# EAGLE design hrobot (EAGLE 9.6.2)
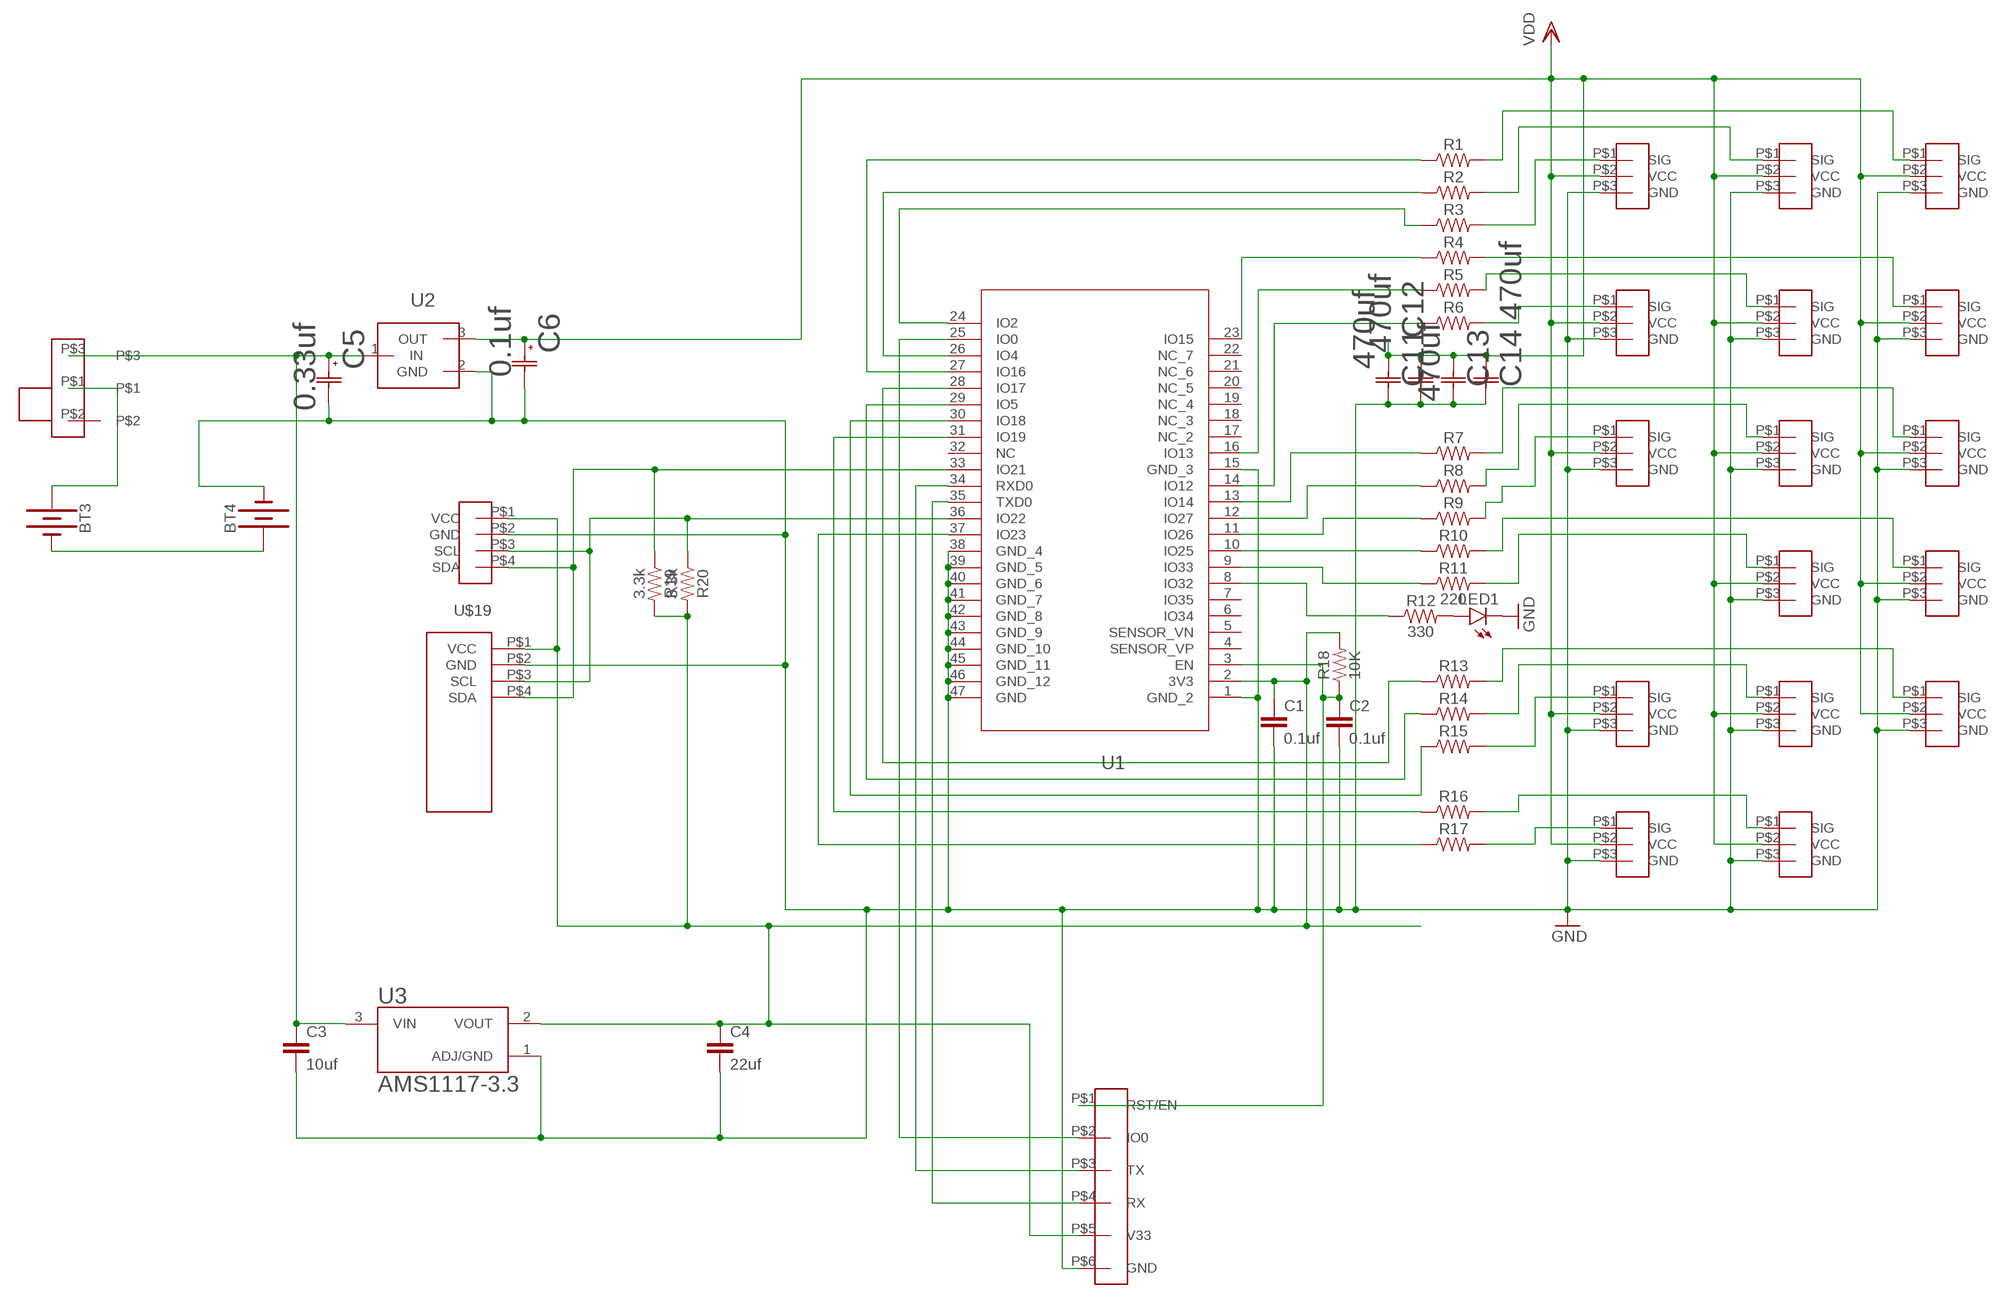
[diagram p0: schematic, sheet 1]

## Parts
BT3  BATTERY-18650  [BATTERY_18650-HOLDER]
BT4  BATTERY-18650  [BATTERY_18650-HOLDER]
C1  0.1uf  CAP-0805  [0805]
C2  0.1uf  CAP-0805  [0805]
C3  10uf  CAP-0805  [0805]
C4  22uf  CAP-0805  [0805]
C5  0.33uf  UWP1HR33MCL1GBCAP_UWF_4X5P4_NCH  [CAP_UWF_4X5P4_NCH]
C6  0.1uf  UZR1H0R1MCL1GBCAP_UZE_4X3P9_NCH  [CAP_UZE_4X3P9_NCH]
C11  470uf  16TZV470M8X10.5CAP_J-V_8X10P5_RUB  [CAP_J-V_8X10P5_RUB]
C12  470uf  16TZV470M8X10.5CAP_J-V_8X10P5_RUB  [CAP_J-V_8X10P5_RUB]
C13  470uf  16TZV470M8X10.5CAP_J-V_8X10P5_RUB  [CAP_J-V_8X10P5_RUB]
C14  470uf  16TZV470M8X10.5CAP_J-V_8X10P5_RUB  [CAP_J-V_8X10P5_RUB]
LED1  LEDSML0805  [SML0805]
R1  RESISTOR0805  [0805]
R2  RESISTOR0805  [0805]
R3  RESISTOR0805  [0805]
R4  RESISTOR0805  [0805]
R5  RESISTOR0805  [0805]
R6  RESISTOR0805  [0805]
R7  RESISTOR0805  [0805]
R8  RESISTOR0805  [0805]
R9  RESISTOR0805  [0805]
R10  RESISTOR0805  [0805]
R11  220  RESISTOR0805  [0805]
R12  330  RESISTOR0805  [0805]
R13  RESISTOR0805  [0805]
R14  RESISTOR0805  [0805]
R15  RESISTOR0805  [0805]
R16  RESISTOR0805  [0805]
R17  RESISTOR0805  [0805]
R18  10K  RESISTOR0805  [0805]
R19  3.3k  RESISTOR0805  [0805]
R20  3.3k  RESISTOR0805  [0805]
U1  ESP32-WROOM-32E_(4MB)ESP32�WROOM�32E_EXP  [ESP32�WROOM�32E_EXP]
U2  L7806  L7805  [L7805FOOT]
U3  AMS1117-3.3  [SOT229P700X180-4N]
U$1  SERVO  [3PINS]
U$2  SERVO  [3PINS]
U$3  SERVO  [3PINS]
U$5  SERVO  [3PINS]
U$6  SERVO  [3PINS]
U$7  SERVO  [3PINS]
U$8  SERVO  [3PINS]
U$9  SERVO  [3PINS]
U$10  SERVO  [3PINS]
U$11  SERVO  [3PINS]
U$12  SERVO  [3PINS]
U$13  SERVO  [3PINS]
U$14  SERVO  [3PINS]
U$15  SERVO  [3PINS]
U$16  SERVO  [3PINS]
U$17  SERVO  [3PINS]
U$18  OLEDVCC  [OLEPINS]
U$19  GYRO  [4PINS]
U$20  PWR3PINS  [PWR3PINS]
U$23  USBCOUT  [6PINS]

## Nets
3V3: C1.1 C4.1 R18.2 R19.2 R20.2 U1.2(3V3) U3.2(VOUT) U$18.P$1(VCC) U$19.P$1(VCC) U$23.P$5(V33)
GND: BT4.GND@1(-) C1.2 C2.2 C3.2 C4.2 C5.2 C6.2 C11.2 C12.2 C13.2 C14.2 LED1.C U1.1(GND_2) U1.15(GND_3) U1.38(GND_4) U1.39(GND_5) U1.40(GND_6) U1.41(GND_7) U1.42(GND_8) U1.43(GND_9) U1.44(GND_10) U1.45(GND_11) U1.46(GND_12) U1.47(GND) U2.2(GND) U3.1(ADJ/GND) U$1.P$3(GND) U$2.P$3(GND) U$3.P$3(GND) U$5.P$3(GND) U$6.P$3(GND) U$7.P$3(GND) U$8.P$3(GND) U$9.P$3(GND) U$10.P$3(GND) U$11.P$3(GND) U$12.P$3(GND) U$13.P$3(GND) U$14.P$3(GND) U$15.P$3(GND) U$16.P$3(GND) U$17.P$3(GND) U$18.P$2(GND) U$19.P$2(GND) U$23.P$6(GND)
N$1: BT3.GND@1(-) BT4.PWR@1(+)
N$2: BT3.PWR@1(+) U$20.P$1
N$4: R3.2 U$1.P$1(SIG)
N$5: R2.2 U$7.P$1(SIG)
N$6: R1.2 U$13.P$1(SIG)
N$7: R6.2 U$2.P$1(SIG)
N$8: R5.2 U$8.P$1(SIG)
N$9: R4.2 U$14.P$1(SIG)
N$10: R9.2 U$3.P$1(SIG)
N$11: R8.2 U$9.P$1(SIG)
N$12: R7.2 U$15.P$1(SIG)
N$13: LED1.A R12.2
N$14: R11.2 U$10.P$1(SIG)
N$15: R10.2 U$16.P$1(SIG)
N$16: R15.2 U$5.P$1(SIG)
N$17: R14.2 U$11.P$1(SIG)
N$18: R13.2 U$17.P$1(SIG)
N$19: R17.2 U$6.P$1(SIG)
N$20: R16.2 U$12.P$1(SIG)
N$21: C3.1 C5.1 U2.1(IN) U3.3(VIN) U$20.P$3
N$22: R16.1 U1.31(IO19)
N$23: R1.1 U1.27(IO16)
N$24: R2.1 U1.26(IO4)
N$25: C2.1 R18.1 U1.3(EN) U$23.P$1(RST/EN)
N$26: R4.1 U1.23(IO15)
N$27: R5.1 U1.16(IO13)
N$28: R6.1 U1.14(IO12)
N$29: R17.1 U1.37(IO23)
N$31: R14.1 U1.29(IO5)
N$32: R15.1 U1.30(IO18)
N$34: R13.1 U1.28(IO17)
N$35: R19.1 U1.33(IO21) U$18.P$4(SDA) U$19.P$4(SDA)
N$36: R11.1 U1.9(IO33)
N$37: R10.1 U1.10(IO25)
N$38: R9.1 U1.11(IO26)
N$39: R8.1 U1.12(IO27)
N$40: R7.1 U1.13(IO14)
N$42: R20.1 U1.36(IO22) U$18.P$3(SCL) U$19.P$3(SCL)
N$45: R12.1 U1.8(IO32)
N$46: R3.1 U1.24(IO2)
N$54: U1.35(TXD0) U$23.P$4(RX)
N$55: U1.34(RXD0) U$23.P$3(TX)
N$57: U1.25(IO0) U$23.P$2(IO0)
VDD: C6.1 C11.1 C12.1 C13.1 C14.1 U2.3(OUT) U$1.P$2(VCC) U$2.P$2(VCC) U$3.P$2(VCC) U$5.P$2(VCC) U$6.P$2(VCC) U$7.P$2(VCC) U$8.P$2(VCC) U$9.P$2(VCC) U$10.P$2(VCC) U$11.P$2(VCC) U$12.P$2(VCC) U$13.P$2(VCC) U$14.P$2(VCC) U$15.P$2(VCC) U$16.P$2(VCC) U$17.P$2(VCC)
Unconnected: U1.4(SENSOR_VP) U1.5(SENSOR_VN) U1.6(IO34) U1.7(IO35) U1.17(NC_2) U1.18(NC_3) U1.19(NC_4) U1.20(NC_5) U1.21(NC_6) U1.22(NC_7) U1.32(NC) U$20.P$2

## Library data of the parts
BT3 BT4 = SparkFun-Batteries:BATTERY: Battery - Single Cell A variety of battery chemistries, sizes, and footprints. Device List: 20MM_PTH - Coin Cell Battery Holder - 20mm (PTH) <https://www.sparkfun.com/products/783> 20MM_PTH_KIT- Coin Cell battery Holder - 20 mm (PTH) <http://www.sparkfun.com/products/783>kit version with special mask 6.8MM_PTH - Coin Cell Battery Holder - 6.8MM(SMD) <https://www.digikey.com/product-detail/en/seiko-instruments/MS621FE-FL11E/728-1057-ND/1889208?WT.srch=1&gclid=CNOQ5a6LzdQCFZS2wAodXCkE0g> 12MM_SMD - Coin Cell Battery Holder - 12mm (SMD) <https://www.sparkfun.com/products/10592> 12MM_PTH - Coin Cell Battery Holder - 12mm (PTH) <https://www.sparkfun.com/products/7948> 20MM_SMD - 20mm Coin Cell Battery Holder (SMD) (2 legs) Used on the Big Time Watch Kit <https://www.sparkfun.com/products/11734> 20MM_SMD_4LEGS - Coin Cell Battery Holder - 20mm (SMD) <https://www.sparkfun.com/products/11892> 20MM_SMD_4LEGS_OVERPASTE - Coin Cell Battery Holder - 20mm (SMD) <https://www.sparkfun.com/products/11892> (Over-paste on the legs) 24.5MM_PTH - Coin Cell Battery Holder - 24.5mm (PTH) <https://www.sparkfun.com/products/8863> 9V - 9V Battery Holder - PC Mount Used on the SparkFun SparkPunk Sound Kit <https://www.sparkfun.com/products/11177> and SparkFun SparkPunk Sequencer Kit <https://www.sparkfun.com/products/12707> 18650 - Battery Holder - 18650 (PTH) <https://www.sparkfun.com/products/13113> AA - Battery Holder - 1xAA (PTH) <https://www.sparkfun.com/products/7949> AAA - Battery Holder - 1xAAA (PTH) <https://www.sparkfun.com/products/12718> AA_KIT - Battery Holder - 1xAA (PTH) <https://www.sparkfun.com/products/7949> Special kit package - pads only have exposed copper on one side of the board. AAA_KIT - Battery Holder - 1xAAA (PTH) <https://www.sparkfun.com/products/12718> Special kit package - pads only have exposed copper on one side of the board.; PROD_ID: BATT-12327; SF_SKU: PRT-13113
C1-C4 = SparkFun-Capacitors:CAP
C5 = Al0.33uf:UWP1HR33MCL1GB; COPYRIGHT: Copyright (C) 2025 Ultra Librarian. All rights reserved.; MANUFACTURER_PART_NUMBER: UWP1HR33MCL1GB; MFR_NAME: Nichicon
C6 = Al0.1uf:UZR1H0R1MCL1GB; COPYRIGHT: Copyright (C) 2025 Ultra Librarian. All rights reserved.; MANUFACTURER_PART_NUMBER: UZR1H0R1MCL1GB; MFR_NAME: Nichicon
C11-C14 = 2024-09-17_10-39-46_Library:16TZV470M8X10.5; COPYRIGHT: Copyright (C) 2024 Ultra Librarian. All rights reserved.; MANUFACTURER_PART_NUMBER: 16TZV470M8X10.5; MFR_NAME: Rubycon
LED1 = led:LED: LED OSRAM: - CHIPLED LG R971, LG N971, LY N971, LG Q971, LY Q971, LO R971, LY R971 LH N974, LH R974 LS Q976, LO Q976, LY Q976 LO Q996 - Hyper CHIPLED LW Q18S LB Q993, LB Q99A, LB R99A - SideLED LS A670, LO A670, LY A670, LG A670, LP A670 LB A673, LV A673, LT A673, LW A673 LH A674 LY A675 LS A676, LA A676, LO A676, LY A676, LW A676 LS A679, LY A679, LG A679 - Hyper Micro SIDELED® LS Y876, LA Y876, LO Y876, LY Y876 LT Y87S - SmartLED LW L88C, LW L88S LB L89C, LB L89S, LG L890 LS L89K, LO L89K, LY L89K LS L896, LA L896, LO L896, LY L896 - TOPLED LS T670, LO T670, LY T670, LG T670, LP T670 LSG T670, LSP T670, LSY T670, LOP T670, LYG T670 LG T671, LOG T671, LSG T671 LB T673, LV T673, LT T673, LW T673 LH T674 LS T676, LA T676, LO T676, LY T676, LB T676, LH T676, LSB T676, LW T676 LB T67C, LV T67C, LT T67C, LS T67K, LO T67K, LY T67K, LW E67C LS E67B, LA E67B, LO E67B, LY E67B, LB E67C, LV E67C, LT E67C LW T67C LS T679, LY T679, LG T679 LS T770, LO T770, LY T770, LG T770, LP T770 LB T773, LV T773, LT T773, LW T773 LH T774 LS E675, LA E675, LY E675, LS T675 LS T776, LA T776, LO T776, LY T776, LB T776 LHGB T686 LT T68C, LB T68C - Hyper Mini TOPLED® LB M676 - Mini TOPLED Santana® LG M470 LS M47K, LO M47K, LY M47K Source: http://www.osram.convergy.de LUXEON: - LUMILED® LXK2-PW12-R00, LXK2-PW12-S00, LXK2-PW14-U00, LXK2-PW14-V00 LXK2-PM12-R00, LXK2-PM12-S00, LXK2-PM14-U00 LXK2-PE12-Q00, LXK2-PE12-R00, LXK2-PE12-S00, LXK2-PE14-T00, LXK2-PE14-U00 LXK2-PB12-K00, LXK2-PB12-L00, LXK2-PB12-M00, LXK2-PB14-N00, LXK2-PB14-P00, LXK2-PB14-Q00 LXK2-PR12-L00, LXK2-PR12-M00, LXK2-PR14-Q00, LXK2-PR14-R00 LXK2-PD12-Q00, LXK2-PD12-R00, LXK2-PD12-S00 LXK2-PH12-R00, LXK2-PH12-S00 LXK2-PL12-P00, LXK2-PL12-Q00, LXK2-PL12-R00 Source: www.luxeon.com KINGBRIGHT: KA-3528ASYC Source: www.kingbright.com
R1-R20 = SparkFun-Resistors:RESISTOR: Generic Resistor Package
U1 = 2024-11-24_23-16-38_Library:ESP32-WROOM-32E_(4MB); COPYRIGHT: Copyright (C) 2024 Ultra Librarian. All rights reserved.; MANUFACTURER_PART_NUMBER: ESP32-WROOM-32E (4MB); MFR_NAME: Espressif Systems
U2 = MouseLib:L7805
U3 = AMS1117-3.3:AMS1117-3.3: Sot223/Pkg 1-Amp 3.3-Volt Low Drop Out Voltage Regulatator; AVAILABILITY: Unavailable; DESCRIPTION: Sot223/Pkg 1-Amp 3.3-Volt Low Drop Out Voltage Regulatator; MF: Advanced Monolithic Systems; MP: AMS1117-3.3; PACKAGE: None; PRICE: None
U$1-U$3 U$5-U$17 = MouseLib:SERVO
U$18 = MouseLib:OLEDVCC
U$19 = MouseLib:GYRO
U$20 = MouseLib:PWR3PINS
U$23 = MouseLib:USBCOUT

## Board
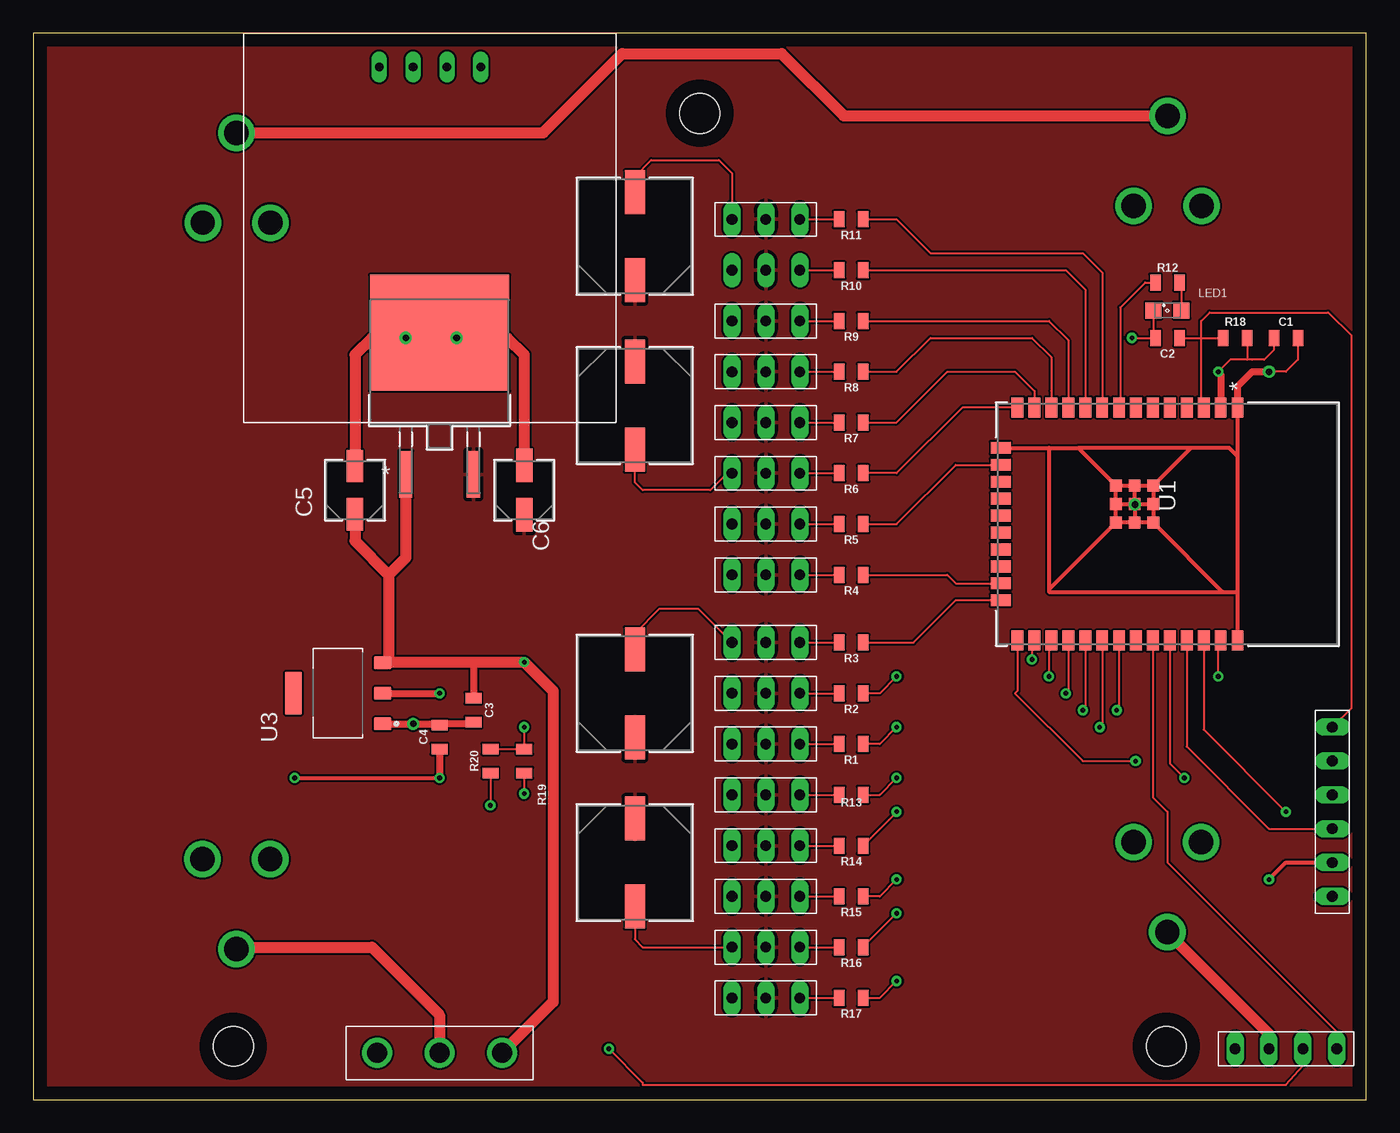
[diagram p1: board, top side]
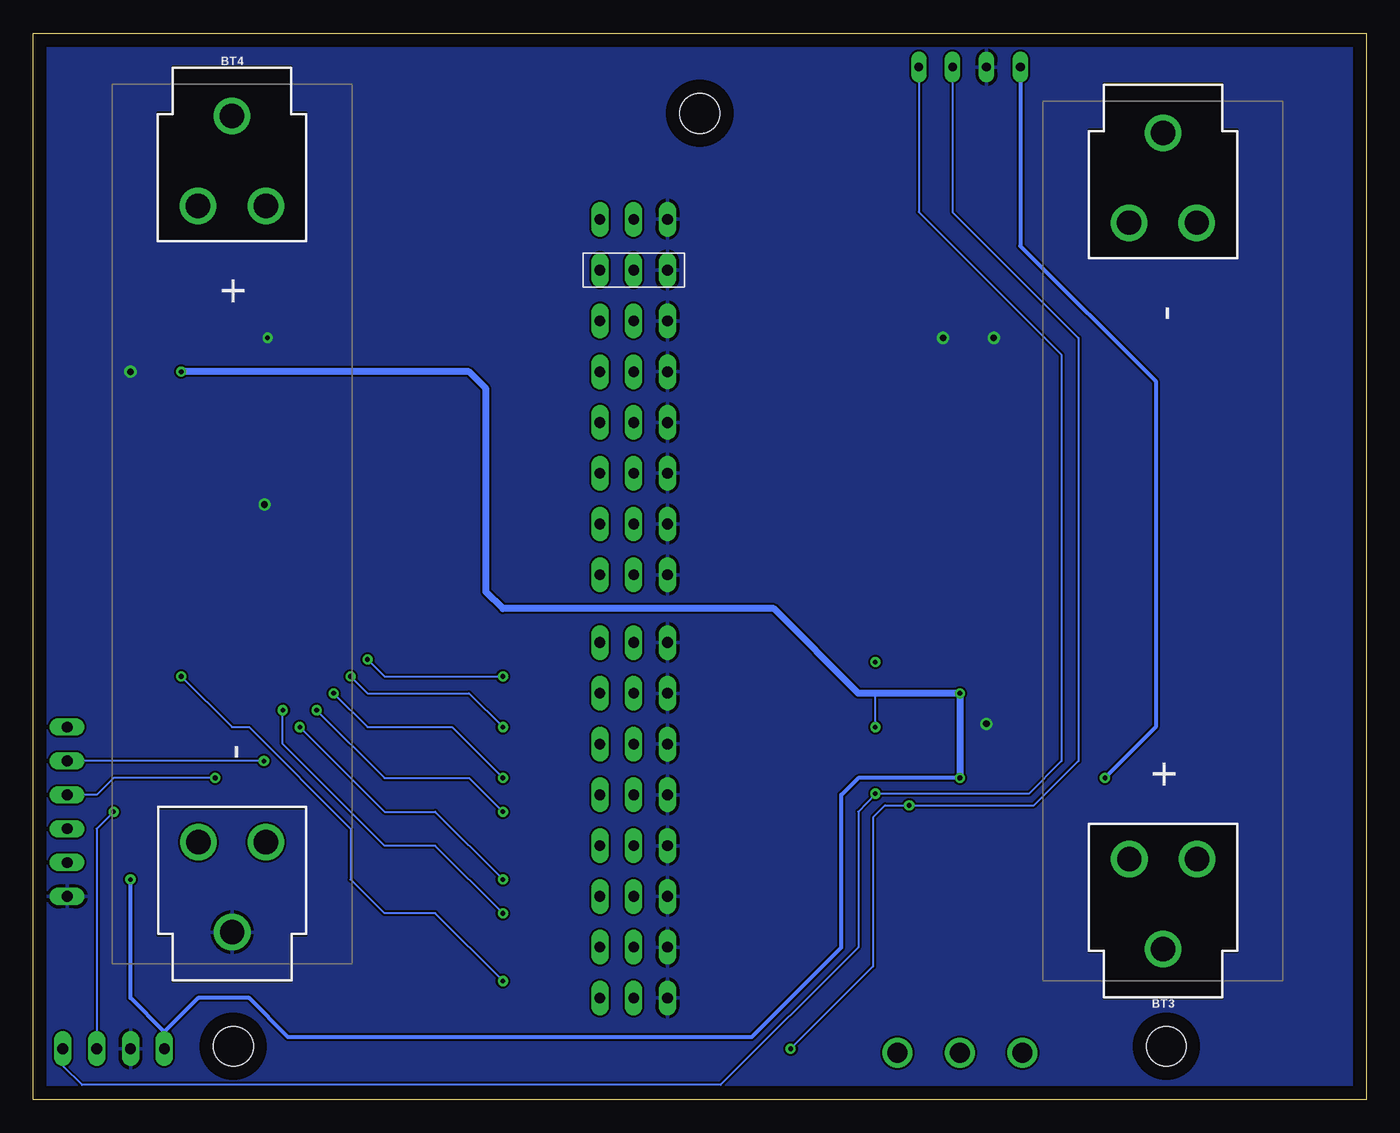
[diagram p2: board, bottom side, seen from below]

Size 100 x 80 mm. Coordinates in mm from the lower left corner, seen from the top.
Outline: 0,0 100,0 100,80 0,80 0,0
Copper layers (1*16): Top 0.035mm / dielectric 1.5mm / Bottom 0.035mm
Design rules "default": minimum track width 6mil, minimum drill 0.35mm, track to track 6mil, track to pad 6mil, pad to pad 6mil, via to via 6mil, smd to smd 6mil, copper to edge 40mil, drill to drill 6mil, minimum pad ring 10mil, minimum via ring 8mil, stop-mask expansion 4mil, vias tented up to drill 0mil, thermal gap 10mil
Holes 3 mm at 15,4 50,74 85,4

### Footprints (pad centres in the part's own frame; a part is rotated, then mirrored left to right if it is on the bottom)
BATTERY_18650-HOLDER = drill 1.829: GND@1 30.628,0.01; GND@2 23.88,2.55; GND@3 23.88,-2.53; PWR@1 -30.628,-0.01; PWR@2 -23.88,2.53; PWR@3 -23.88,-2.55
0805 = smd 0.8 x 1.2: 1 -0.9,0; 2 0.9,0
CAP_UWF_4X5P4_NCH = smd 2.413 x 1.219: 1 -1.803,0; 2 1.803,0
CAP_UZE_4X3P9_NCH = smd 2.515 x 1.219: 1 -1.854,0; 2 1.854,0
CAP_J-V_8X10P5_RUB = smd 3.302 x 1.499: 1 -3.302,0; 2 3.302,0
SML0805 = smd 1.2 x 1.2: A 1.05,0; C -1.05,0
ESP32�WROOM�32E_EXP = smd 1.499 x 0.889: 1 -8.75,5.26; 2 -8.75,3.99; 3 -8.75,2.72; 4 -8.75,1.45; 5 -8.75,0.18; 6 -8.75,-1.09; 7 -8.75,-2.36; 8 -8.75,-3.63; 9 -8.75,-4.9; 10 -8.75,-6.17; 11 -8.75,-7.44; 12 -8.75,-8.71; 13 -8.75,-9.98; 14 -8.75,-11.25; 25 8.75,-11.25; 26 8.75,-9.98; 27 8.75,-8.71; 28 8.75,-7.44; 29 8.75,-6.17; 30 8.75,-4.9; 31 8.75,-3.63; 32 8.75,-2.36; 33 8.75,-1.09; 34 8.75,0.18; 35 8.75,1.45; 36 8.75,2.72; 37 8.75,3.99; 38 8.75,5.26 | smd 0.889 x 1.499: 15 -5.715,-12.501; 16 -4.445,-12.501; 17 -3.175,-12.501; 18 -1.905,-12.501; 19 -0.635,-12.501; 20 0.635,-12.501; 21 1.905,-12.501; 22 3.175,-12.501; 23 4.445,-12.501; 24 5.715,-12.501 | smd 0.889 x 0.889: 39 -1.501,-2.461; 40 -2.901,-1.062; 41 -2.901,-2.461; 42 -2.901,-3.861; 43 -1.501,-3.861; 44 -0.102,-3.861; 45 -0.102,-2.461; 46 -0.102,-1.062; 47 -1.501,-1.062
L7805FOOT = smd 0.991 x 3.505: 1 -2.54,-5.893; 3 2.54,-5.893 | smd 10.439 x 8.712: 2 0,4.737
SOT229P700X180-4N = smd 0.93 x 1.31: 1 -2.29,-3.345; 2 0,-3.345; 3 2.29,-3.345 | smd 3.24 x 1.31: 4 0,3.345
3PINS = drill 0.8 pad 1.143 long: P$1 0,2.54; P$2 0,0; P$3 0,-2.54
OLEPINS = drill 0.65 long: P$1 -3.81,12.7; P$2 -1.27,12.7; P$3 1.27,12.7; P$4 3.81,12.7
4PINS = drill 0.8 pad 1.143 long: P$1 0,3.81; P$2 0,1.27; P$3 0,-1.27; P$4 0,-3.81
PWR3PINS = drill 1.5: P$1 0,0; P$2 4.7,0; P$3 -4.7,0
6PINS = drill 0.8 pad 1.143 long: P$1 -2.54,10.16; P$2 -2.54,7.62; P$3 -2.54,5.08; P$4 -2.54,2.54; P$5 -2.54,0; P$6 -2.54,-2.54

### Placement (x,y rotation side)
BT3  15.24,41.91 90 bottom
BT4  85.09,43.18 270 bottom
C1  93.98,57.15 0 top
C2  85.09,57.15 180 top
C3  33.02,29.21 270 top
C4  30.48,27.2 90 top
C5  24.13,45.72 90 top
C6  36.83,45.72 90 top
C11  45.13,17.78 270 top
C12  45.13,30.48 90 top
C13  45.13,64.77 90 top
C14  45.13,52.07 270 top
LED1  85.09,59.2 0 top
R1  61.36,26.67 180 top
R2  61.36,30.48 180 top
R3  61.36,34.29 180 top
R4  61.36,39.37 180 top
R5  61.36,43.18 180 top
R6  61.36,46.99 180 top
R7  61.36,50.8 180 top
R8  61.36,54.61 180 top
R9  61.36,58.42 180 top
R10  61.36,62.23 180 top
R11  61.36,66.04 180 top
R12  85.09,61.31 0 top
R13  61.36,22.86 180 top
R14  61.36,19.05 180 top
R15  61.36,15.24 180 top
R16  61.36,11.43 180 top
R17  61.36,7.62 180 top
R18  90.17,57.15 0 top
R19  36.83,25.4 90 top
R20  34.29,25.4 90 top
U1  85.09,43.18 270 top
U2  30.48,52.8 0 top
U3  22.86,30.48 90 top
U$1  54.96,34.29 270 top
U$2  54.96,46.99 270 top
U$3  54.96,58.42 270 top
U$5  54.96,15.24 270 top
U$6  54.96,7.62 270 top
U$7  54.96,30.48 270 top
U$8  54.96,43.18 270 top
U$9  54.96,54.61 270 top
U$10  54.96,66.04 270 top
U$11  54.96,19.05 270 top
U$12  54.96,11.43 270 top
U$13  54.96,26.67 270 top
U$14  54.96,39.37 270 top
U$15  54.96,50.8 270 top
U$16  54.96,62.23 90 bottom
U$17  54.96,22.86 270 top
U$18  29.76,64.77 0 top
U$19  93.98,3.81 90 top
U$20  30.48,3.5 180 top
U$23  100,17.78 0 top

### Tracks (layer width: path | path; a pad name or v marks a point on that pad's centre or on a via)
3V3  (via drill 0.35)
  Top 0.152: R20.2 R19.2 v36.83,27.94 | R18.2 91.07,55.51 | C1.1 93.08,56.25 92.34,55.51 91.44,55.51 91.07,55.51 | 91.07,55.51 89.8,55.51 v88.9,54.61
  Top 0.305: v19.6,24.13 v30.48,24.13 | v92.71,16.51 93.98,17.78 U$23.P$5
  Top 0.508: U3.2 v30.48,30.48 | v88.9,54.61 89.08,54.43 U1.2 | C4.1 v30.48,24.13
  Bottom 0.152: v36.83,27.94 36.83,30.48
  Bottom 0.305: v30.48,24.13 38.1,24.13 39.37,22.86 39.37,11.43 46.12,4.68 80.88,4.68 83.82,7.62 87.63,7.62 90.17,5.08 | v19.6,24.13 15.79,27.94 15.79,53.89 25.95,64.05 U$18.P$1 | U$19.P$1 90.17,5.08 | 90.17,5.08 92.71,7.62 v92.71,16.51
  Bottom 0.508: v30.48,24.13 v30.48,30.48 36.83,30.48 38.1,30.48 44.45,36.83 64.77,36.83 66.04,38.1 66.04,53.34 67.31,54.61 v88.9,54.61
GND  (via drill 0.35, 0.5)
  Top 0.152: 45.84,48.06 C14.2 45.13,46.31 45.72,45.72 50.8,45.72 52.07,46.99 U$2.P$3 | C12.2 45.13,34.97 46.99,36.83 49.88,36.83 U$1.P$3 | C11.2 45.13,12.02 45.72,11.43 U$12.P$3 | U1.1 90.17,52.11 | U1.42 81.28,46.08 81.23,46.03 | U1.40 84.03,45.72 | 81.28,44.68 U1.43 | U$10.P$3 52.42,69.5 51.44,70.48 46.35,70.48 45.13,69.26 C13.2 | v82.43,57.15 C2.2 84.04,57.3 LED1.C | C1.2 94.88,55.51 93.98,54.61 v92.71,54.61
  Top 0.305: U1.40 84.39,46.08 84.03,45.72 | U1.47 84.03,44.45 | U1.38 90.35,38.1 | U1.42 78.42,48.9 | U1.15 76.2,48.9 | 76.2,48.9 78.42,48.9 | 90.17,51.89 90.35,52.07 | 76.2,48.9 76.2,38.25 | 89.21,38.1 76.2,38.1 76.2,38.25 | 90.35,38.1 90.35,48.26 | 90.35,48.26 U1.1 | 90.35,48.26 89.72,48.9 86.84,48.9 | 86.84,48.9 78.42,48.9 | U1.46 89.21,38.1 | 89.21,38.1 90.35,38.1 | U1.44 76.2,38.25 | U1.40 86.84,48.9 | U1.42 U1.41 | U1.41 U1.40 | U1.40 U1.47 | U1.47 84.26,44.45 | U1.47 U1.46 | U1.46 U1.45 | U1.45 U1.44 | U1.44 81.23,44.63 81.28,44.68 | U1.42 U1.43 U1.39 | U1.39 U1.47 | U1.39 U1.41 | U1.39 U1.45 | 92.71,4.92 U$19.P$2 | U3.1 26.42,28.19
  Top 0.508: C3.2 32.9,28.19 30.39,28.19 | U1.1 90.35,52.07 90.35,53.52 91.44,54.61 v92.71,54.61 | 26.42,28.19 v28.5,28.19 30.39,28.19 | 30.39,28.19 C4.2
  Top 0.813: v27.94,57.15 25.4,57.15 24.13,55.88 C5.2 | v27.94,57.15 29.21,57.15 29.21,58.42 30.48,58.42 | 30.48,58.42 v31.75,57.15 35.56,57.15 36.83,55.88 C6.2 | 30.48,58.42 U2.2 30.09,57.15 v27.94,57.15 | BT4.GND@1 92.71,4.92
  other vias: 82.65,44.65
  pour Bottom: -3.81,85.09 110.49,85.09 110.49,-6.35 -3.81,-6.35
  pour Bottom: -6.35,86.36 109.22,86.36 109.22,-5.08 -6.35,-5.08
N$1
  Top 0.813: BT3.GND@1 38.25,72.54 44.19,78.48 56.14,78.48 60.81,73.81 BT4.PWR@1
N$2
  Top 0.813: BT3.PWR@1 15.38,11.43 25.4,11.43 30.48,6.35 U$20.P$1
N$4
  Top 0.152: U$1.P$1 R3.2
N$5
  Top 0.152: U$7.P$1 R2.2
N$6
  Top 0.152: U$13.P$1 R1.2
N$7
  Top 0.152: U$2.P$1 R6.2
N$8
  Top 0.152: U$8.P$1 R5.2
N$9
  Top 0.152: U$14.P$1 R4.2
N$10
  Top 0.152: U$3.P$1 R9.2
N$11
  Top 0.152: U$9.P$1 R8.2
N$12
  Top 0.152: U$15.P$1 R7.2
N$13
  Top 0.152: R12.2 86.14,61.16 LED1.A
N$14
  Top 0.152: U$10.P$1 R11.2
N$15
  Top 0.152: U$16.P$1 R10.2
N$16
  Top 0.152: U$5.P$1 R15.2
N$17
  Top 0.152: U$11.P$1 R14.2
N$18
  Top 0.152: U$17.P$1 R13.2
N$19
  Top 0.152: U$6.P$1 R17.2
N$20
  Top 0.152: U$12.P$1 R16.2
N$21  (via drill 0.35)
  Top 0.508: 33.02,32.82 C3.1
  Top 0.813: U3.3 26.25,32.82 26.67,32.82 | 26.67,32.82 33.02,32.82 v36.83,32.82 39,30.65 39,7.32 U$20.P$3 | 26.67,39.37 26.67,32.82 | 26.67,39.37 24.13,41.91 C5.1 | 26.67,39.37 27.94,40.64 U2.1
N$22  (via drill 0.35)
  Top 0.152: v64.77,13.97 62.26,11.46 R16.1 | U1.31 81.46,29.39 v81.28,29.21
  Bottom 0.152: v64.77,13.97 69.85,19.05 73.66,19.05 81.28,26.67 v81.28,29.21
N$23  (via drill 0.35)
  Top 0.152: U1.27 76.2,34.25 v76.2,31.75 | v64.77,27.94 63.5,26.67 R1.1
  Bottom 0.152: v76.2,31.75 74.93,30.48 67.31,30.48 v64.77,27.94
N$24  (via drill 0.35)
  Top 0.152: U1.26 74.93,34.25 v74.93,33.02 | v64.77,31.75 63.5,30.48 R2.1
  Bottom 0.152: v74.93,33.02 73.66,31.75 v64.77,31.75
N$25
  Top 0.152: R18.1 89.08,56.97 88.9,57.15 87.63,57.15 | U$23.P$1 98.91,29.39 98.91,57.3 97.16,59.05 88.27,59.05 87.63,58.42 87.63,57.15 | C2.1 87.63,57.15 | U1.3 87.63,52.11 87.63,57.15
N$26
  Top 0.152: R4.1 68.58,39.37 69.22,38.73 U1.23
N$27
  Top 0.152: R5.1 64.77,43.18 69.22,47.62 U1.16
N$28
  Top 0.152: U1.14 69.71,51.93 64.77,46.99 R6.1
N$29  (via drill 0.35)
  Top 0.152: v88.9,31.75 88.9,34.25 U1.37 | R17.1 63.5,7.62 v64.77,8.89
  Bottom 0.152: v88.9,31.75 85.09,27.94 83.82,27.94 76.2,20.32 76.2,16.51 73.66,13.97 69.85,13.97 v64.77,8.89
N$31  (via drill 0.35)
  Top 0.152: U1.29 78.92,29.39 v78.74,29.21 | v64.77,21.59 64.77,21.56 R14.1
  Bottom 0.152: v78.74,29.21 73.66,24.13 67.31,24.13 v64.77,21.59
N$32  (via drill 0.35)
  Top 0.152: U1.30 80.19,28.12 v80.01,27.94 | v64.77,16.51 63.5,15.24 R15.1
  Bottom 0.152: v80.01,27.94 73.66,21.59 69.85,21.59 v64.77,16.51
N$34  (via drill 0.35)
  Top 0.152: U1.28 77.65,30.66 v77.47,30.48 | v64.77,24.13 63.5,22.86 R13.1
  Bottom 0.152: v77.47,30.48 74.93,27.94 68.58,27.94 v64.77,24.13
N$35  (via drill 0.35)
  Top 0.152: R19.1 v36.83,22.95 | U1.33 84,22.68 85.09,21.59 85.09,17.78 97.79,5.08 U$19.P$4
  Bottom 0.152: U$19.P$4 97.79,2.54 96.34,1.09 48.44,1.09 38.1,11.43 38.1,21.59 v36.83,22.95 25.32,22.95 22.86,25.41 22.86,55.88 33.57,66.59 U$18.P$4
N$36
  Top 0.152: R11.1 64.77,66.04 67.31,63.5 78.74,63.5 80.19,62.05 U1.9
N$37
  Top 0.152: R10.1 77.47,62.23 78.92,60.78 U1.10
N$38
  Top 0.152: R9.1 76.2,58.42 77.65,56.97 U1.11
N$39
  Top 0.152: U1.12 76.38,52.07 76.38,53.16 76.38,55.7 74.93,57.15 67.31,57.15 64.77,54.61 R8.1
N$40
  Top 0.152: R7.1 64.77,50.8 68.58,54.61 73.66,54.61 75.11,53.16 U1.13
N$42  (via drill 0.35)
  Top 0.152: R20.1 v34.29,22.07 | U1.36 87.81,27.76 v93.98,21.59 | U$19.P$3 95.25,2.54 93.98,1.09 45.72,1.09 45.72,1.27 v43.18,3.81
  Bottom 0.152: v93.98,21.59 95.25,20.32 U$19.P$3 | U$18.P$3 31.03,66.59 21.59,57.15 21.59,25.4 24.92,22.07 v34.29,22.07 36.09,22.07 37,21.16 37,9.99 v43.18,3.81
N$45
  Top 0.152: R12.1 83.43,61.31 81.55,59.42 81.55,52.02 U1.8
N$46
  Top 0.152: R3.1 66.04,34.29 69.22,37.47 U1.24
N$54
  Top 0.152: U1.35 86.54,26.49 92.71,20.32 U$23.P$4
N$55  (via drill 0.35)
  Top 0.152: U1.34 85.27,25.22 v86.36,24.13
  Bottom 0.152: v86.36,24.13 93.98,24.13 95.25,22.86 U$23.P$3
N$57  (via drill 0.35)
  Top 0.152: U1.25 73.84,30.66 73.66,30.48 78.74,25.4 v82.7,25.4
  Bottom 0.152: v82.7,25.4 U$23.P$2
VDD
  pour Top: -12.7,81.28 -12.7,-3.81 105.41,-3.81 105.41,81.28
  pour Top: -12.7,81.28 -12.7,-3.81 104.14,-3.81 104.14,81.28
  pour Top: -11.43,81.28 -11.43,-3.81 106.68,-3.81 106.68,81.28